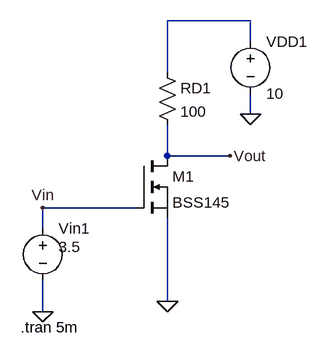
[diagram p0: schematic lab5.1c.asc]
lab5.1c.asc, the LTspice schematic file:
Version 4
SHEET 1 880 680
WIRE 304 -128 176 -128
WIRE 304 -96 304 -128
WIRE 176 -48 176 -128
WIRE 304 16 304 -16
WIRE 176 80 176 32
WIRE 272 80 176 80
WIRE 128 160 -16 160
WIRE -16 192 -16 160
WIRE 176 304 176 176
WIRE -16 320 -16 272
FLAG 304 16 0
FLAG 272 80 Vout
FLAG 176 304 0
FLAG -16 320 0
FLAG -16 160 Vin
SYMBOL voltage 304 -112 R0
WINDOW 123 0 0 Left 0
WINDOW 39 0 0 Left 0
SYMATTR InstName VDD1
SYMATTR Value 10
SYMBOL res 160 -64 R0
SYMATTR InstName RD1
SYMATTR Value 100
SYMBOL nmos 128 80 R0
SYMATTR InstName M1
SYMATTR Value BSS145
SYMBOL voltage -16 176 R0
WINDOW 3 24 44 Left 2
WINDOW 123 0 0 Left 0
WINDOW 39 0 0 Left 0
SYMATTR InstName Vin1
SYMATTR Value 3.5
TEXT -50 344 Left 2 !.tran 5m

The netlist it stands for:
* lab5.1c.asc
VDD1 N001 0 10
RD1 N001 Vout 100
M1 Vout Vin 0 0 BSS145
Vin1 Vin 0 3.5
.model NMOS NMOS
.model PMOS PMOS
.lib standard.mos
.tran 5m
.backanno
.end